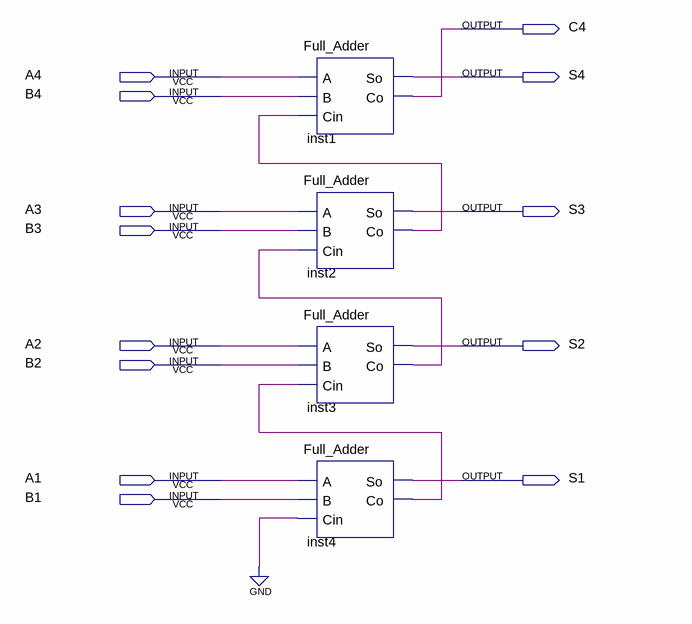
[diagram p0: schematic sheet]
// Quartus schematic 4bit_Full_Adder.bdf as structural Verilog: 4 symbols, 13 pins
module \4bit_Full_Adder  (
  input  A4,
  input  B4,
  input  A3,
  input  B3,
  input  A2,
  input  B2,
  input  A1,
  input  B1,
  output C4,
  output S4,
  output S3,
  output S2,
  output S1
);

  wire inst2_co, inst3_co, inst4_co;

  Full_Adder inst1 (.A(A4), .B(B4), .Cin(inst2_co), .So(S4), .Co(C4));
  Full_Adder inst2 (.A(A3), .B(B3), .Cin(inst3_co), .So(S3), .Co(inst2_co));
  Full_Adder inst3 (.A(A2), .B(B2), .Cin(inst4_co), .So(S2), .Co(inst3_co));
  Full_Adder inst4 (.A(A1), .B(B1), .Cin(1'b0), .So(S1), .Co(inst4_co));
endmodule
